# Altium schematic sheet Boost-converter-controller.SchDoc
size A4; SheetNumber: 1; SheetTotal: 6
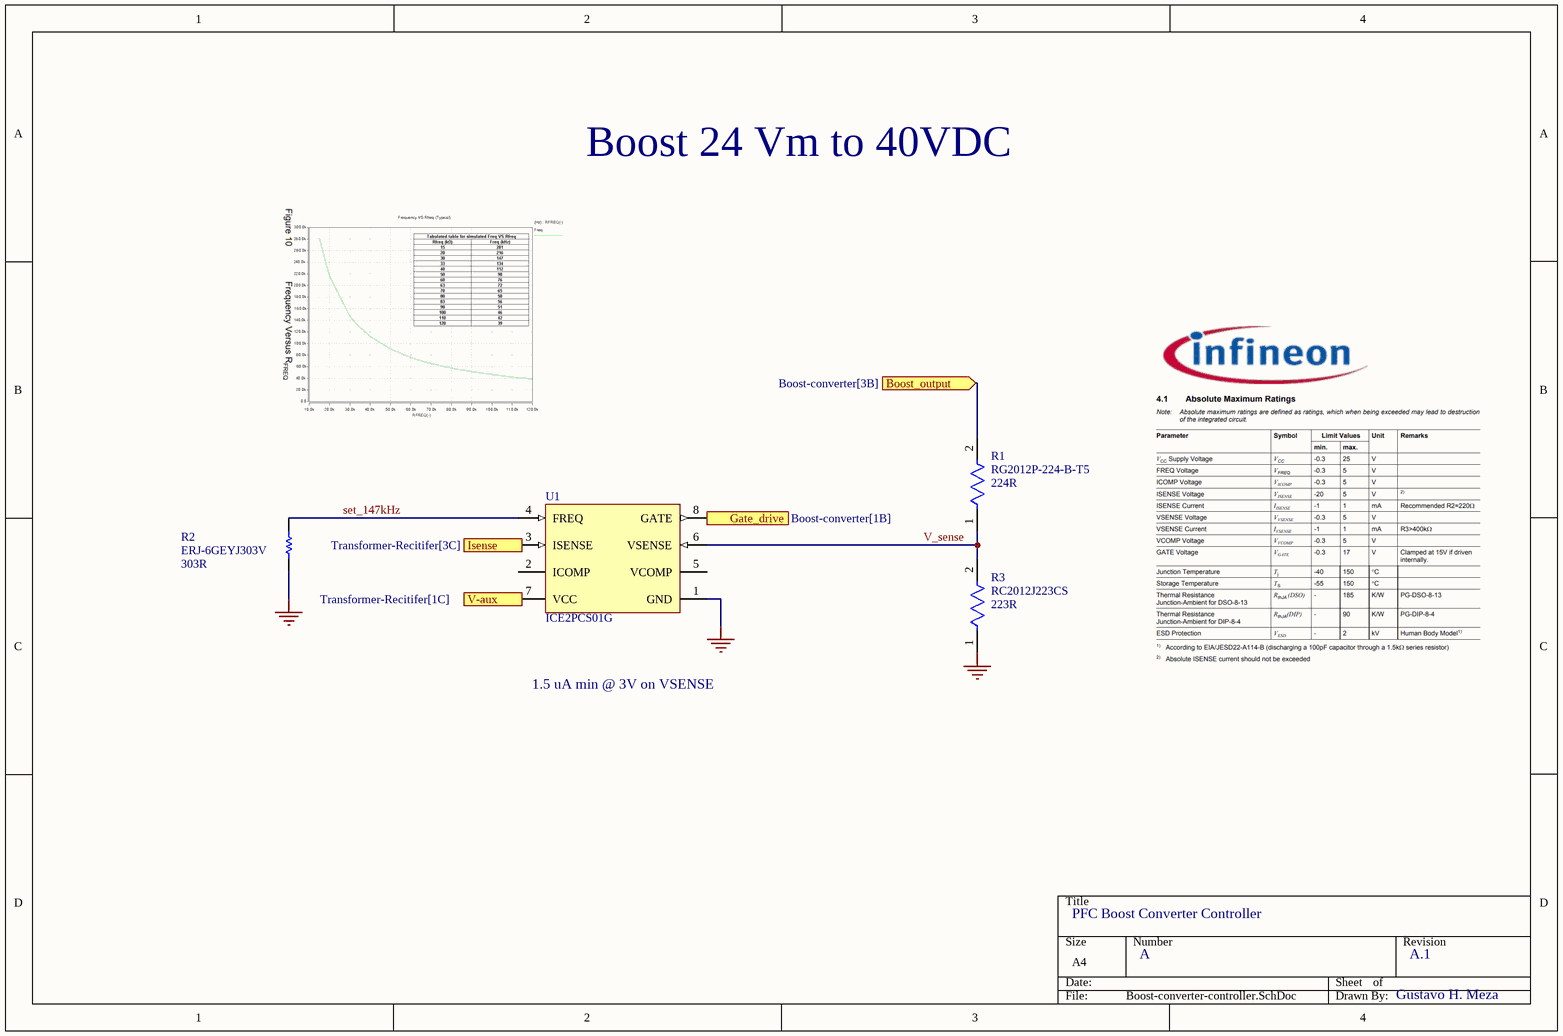
[diagram p0: Boost-converter-controller.SchDoc]

## Parts
R1  RG2012P-224-B-T5  Resistance: 224R  [FP-RG2012-IPC_A]
R2  ERJ-6GEYJ303V  Resistance: 303R  [RESC2013X70X40NL20T20]
R3  RC2012J223CS  Resistance: 223R  [FP-RC2012-IPC_A]
U1  ICE2PCS01G  [INF-PG-DSO-8-16_N]

## Ports
Boost_output (in, see Boost-converter[3B]), Gate_drive (out, see Boost-converter[1B]), Isense (in, see Transformer-Recitifer[3C]), V-aux (in, see Transformer-Recitifer[1C])

## Nets
GND: R2.1 R3.1 U1.1(GND)
Boost_output: R1.2 ; port Boost_output
Gate_drive: U1.8(GATE) ; port Gate_drive
set_147kHz: R2.2 U1.4(FREQ)
V_sense: R1.1 R3.2 U1.6(VSENSE)

Not connected (* = marked no-connect by the designer): U1 2(ICOMP) 3(ISENSE) 5(VCOMP) 7(VCC)

## Notes on the sheet
- Boost 24 Vm to 40VDC
- 1.5 uA min @ 3V on VSENSE
- PFC Boost Converter Controller
- A
- A.1
- Gustavo H. Meza

## Library data of the parts
R1 = CMP-2001-02850-2: Automotive Metal Thin Film Chip Resistor, 0805, 220kΩ, 0.1%, 25ppm/°C, 0.125W, 150V; Voltage Rating: 100V; Power Rating: 100mW; Max Power Dissipation: 125mW; Voltage Rating (DC): 150V; Length: 0.079inch; RoHS Compliant: Yes; Series: RG; Termination: SMD/SMT; Case Code (Metric): 2012; Resistor Type: Thin Film; Lead Free: Lead Free; Number of Terminations: 2; Width: 0.049inch; Features: Automotive AEC-Q200; Case Code (Imperial): 0805; Packaging: Tape and Reel; Min Operating Temperature: -55°C; Max Operating Temperature: 155°C; Case/Package: 0805; Tolerance: 0.1%; Temperature Coefficient: 25ppm/°C; Package Quantity: 1; Height: 0.02inch
R2 = CMP-2001-00396-1: Manufacturer: Panasonic; Part Number: ERJ-6GEYJ303V
R3 = CMP-13261-000383-1: Res Thick Film 0805 22kΩ 5% 0.125W ±100ppm/°C Molded SMD T/R; Voltage Rating (DC): 150V; Max Power Dissipation: 125mW; Packaging: Tape and Reel; Height: 0.024inch; Case/Package: 0805; Tolerance: 5%; Contact Plating: Tin; Package Quantity: 1; Max Operating Temperature: 155°C; Length: 2mm; Military Standard: Not; Min Operating Temperature: -55°C; Temperature Coefficient: 100ppm/°C; Width: 0.049inch; Case Code (Metric): 2012; Depth: 1.25mm; Number of Terminations: 2; Case Code (Imperial): 0805; Radiation Hardening: No; Composition: Thick Film; Lead Free: Lead Free; Features: Moisture Resistant
U1 = CMP-1105-00012-1: Standalone Power Factor Correction (PFC) Controller in Continuous Conduction Mode (CCM), 11 to 26 V, -1.5 A / 2 A Iq, -40 to 125 degC, PG-DSO-8-16, Reel, Green; Manufacturer: Infineon; Output: MOSFET Gate Driver; IQ (max): -1.5Â A / 2 A; Green: TRUE; VCC (max): 26Â V; Group: DSO-8; ICC (max): 20Â mA; Iq (typ): 300Â uA; VCC (min): 11Â V; Frequency ( f ) Range: 50kHz - 250kHz; PackageDescription: 8-Pin Plastic (Green) Dual Small Outline Package, 4.9 x 3.9 mm Body, 1.27 mm Pitch; Mounting Technology: Surface Mount; PackageReference: PG-DSO-8-16; PackageVersion: Mar-07; ComponentLink3Description: Package Specification; ComponentLink3URL: http://www.infineon.com/dgdl/TLE7259-2GE_DS_rev12.pdf?folderId=db3a3043163797a6011666d32a0c0de1&fileId=db3a3043163797a6011666d4dbb80de2&location=en.Products.Automotive_ICs.Automotive_Transceivers.LIN_Transceivers.DATASHEET.TLE7259-2GE_DS_rev12.pdf; Halogen-free: TRUE; ComponentLink1URL: http://www.infineon.com/; ComponentLink1Description: Manufacturer URL; PartNumber: ICE2PCS01G; ComponentLink2URL: http://www.infineon.com/dgdl/ProductDatasheetICE2PCS01_v2_3+Mar+2010.pdf?folderId=db3a304412b407950112b4182a3d24f8&fileId=db3a304412b407950112b427caa43ccf; ComponentLink2Description: Datasheet; DatasheetVersion: Rev. 2.3